# EAGLE board ComputeCalculator (EAGLE 7.2.0)
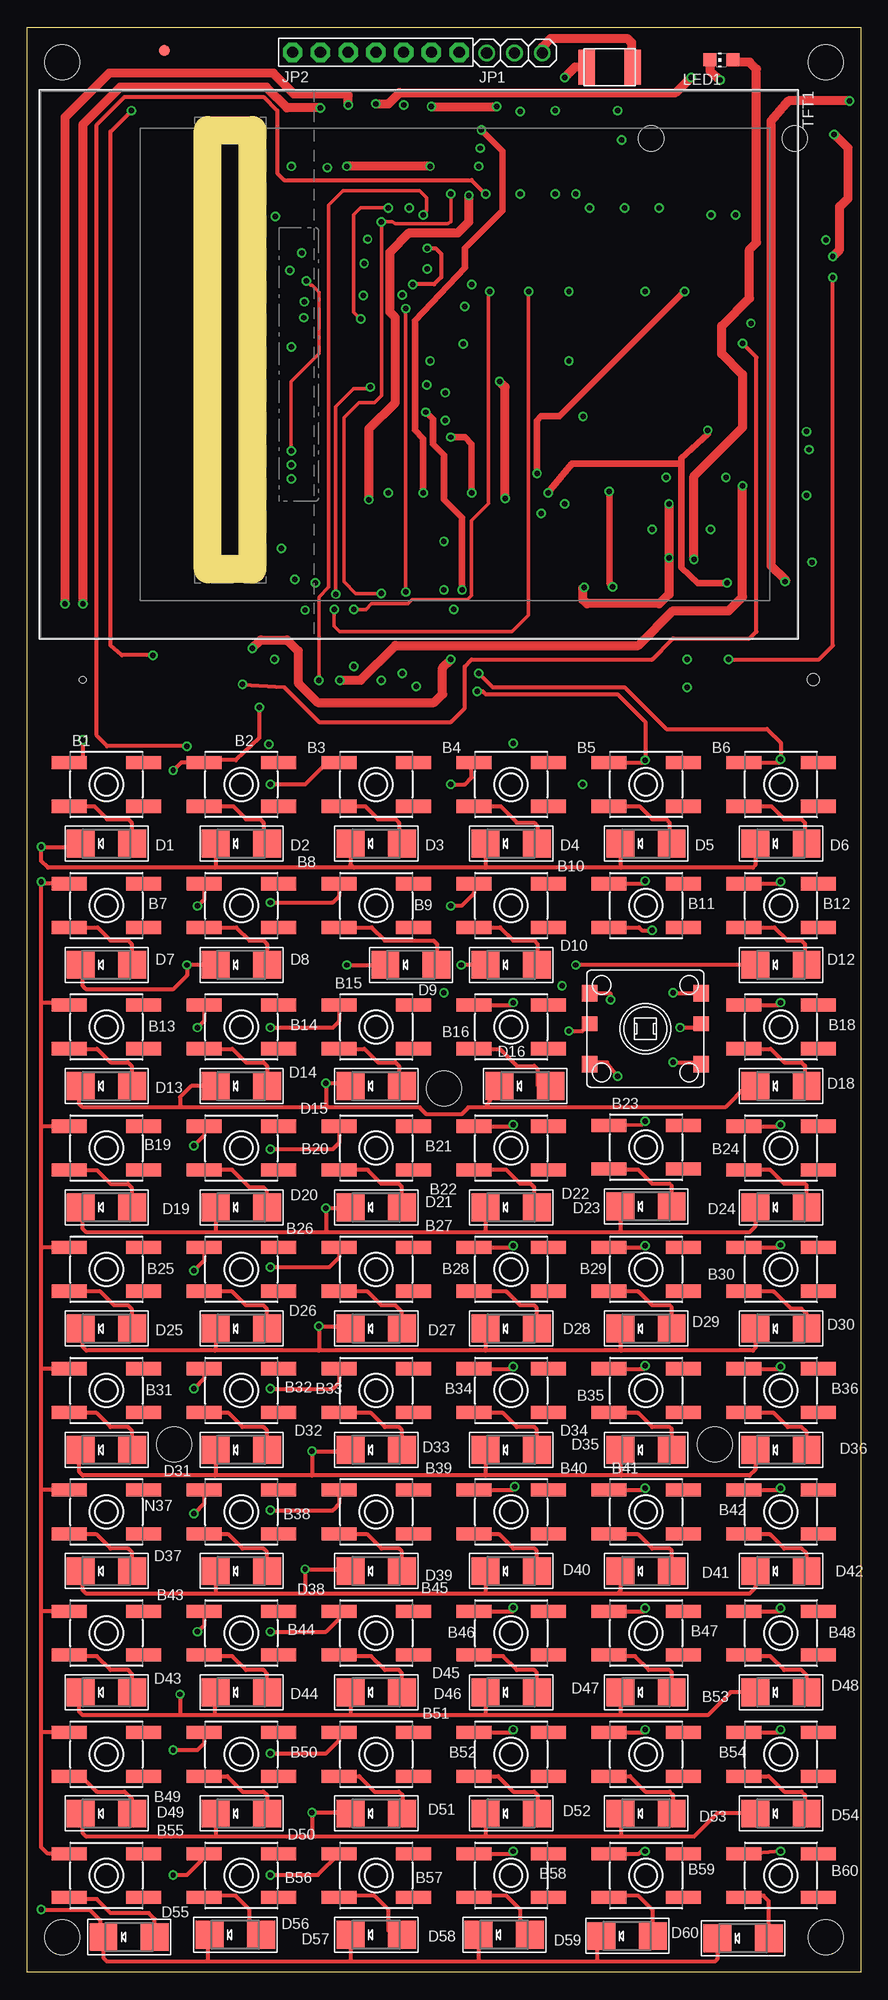
[diagram p5: board, top side]
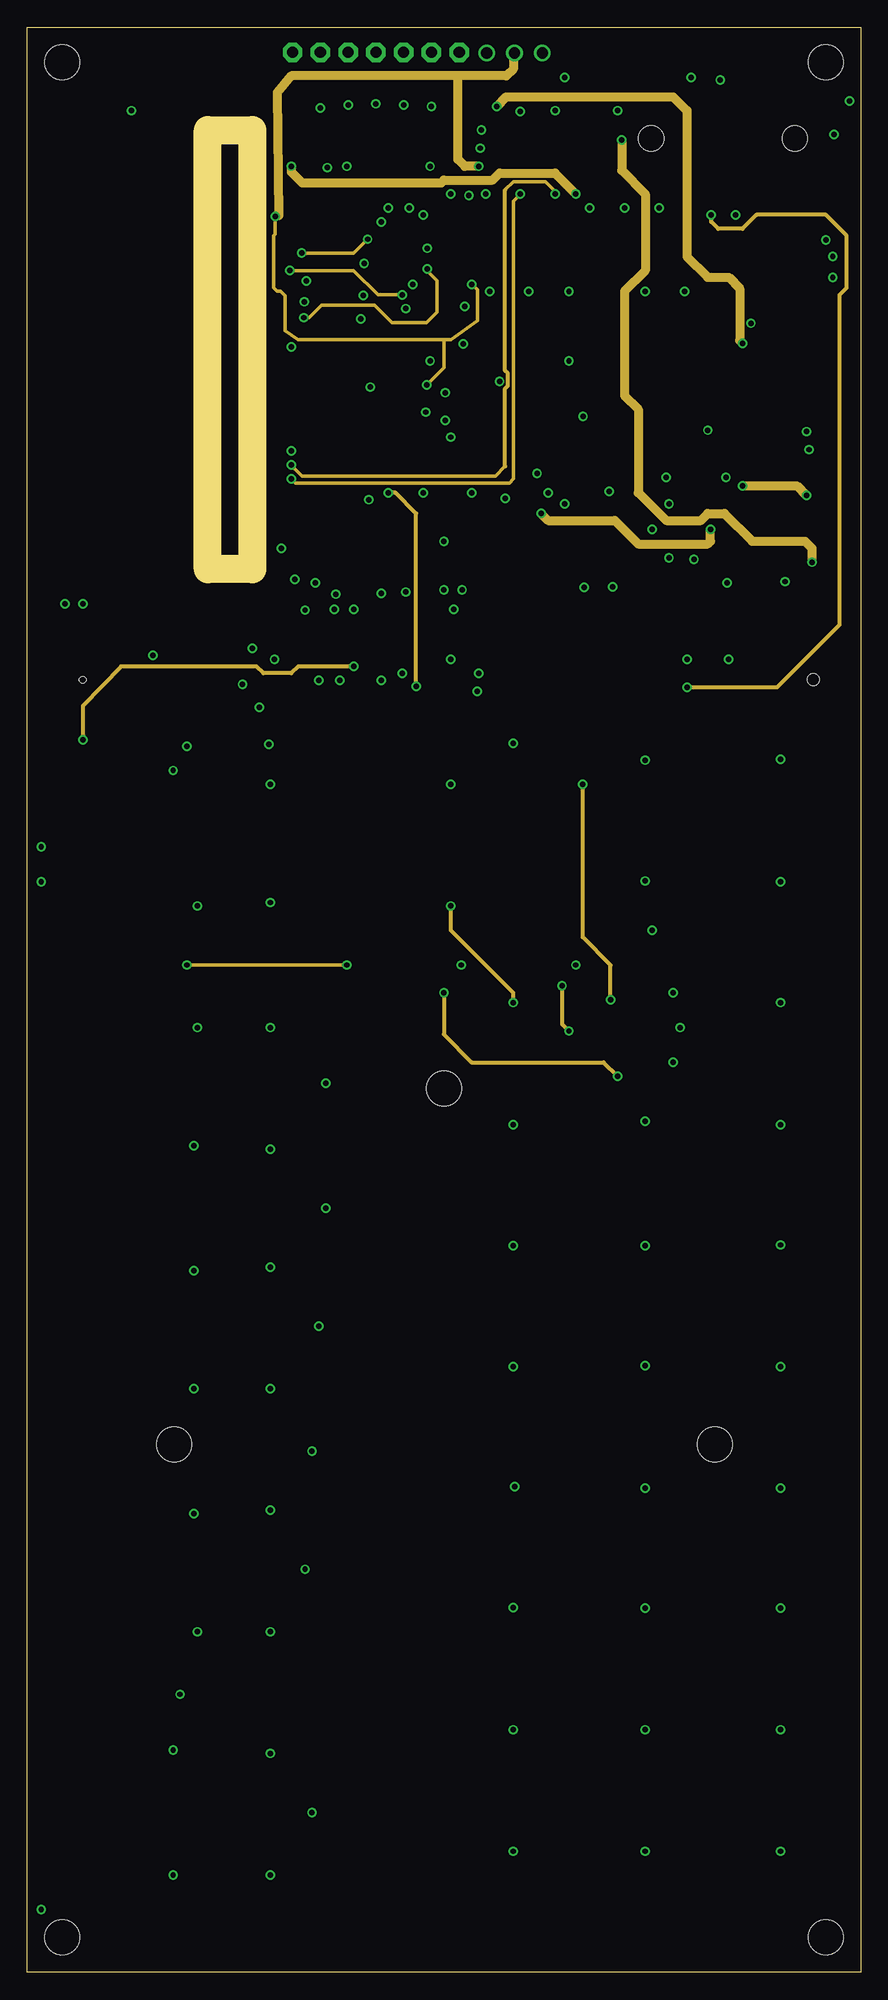
[diagram p6: board, inner layer Route2]
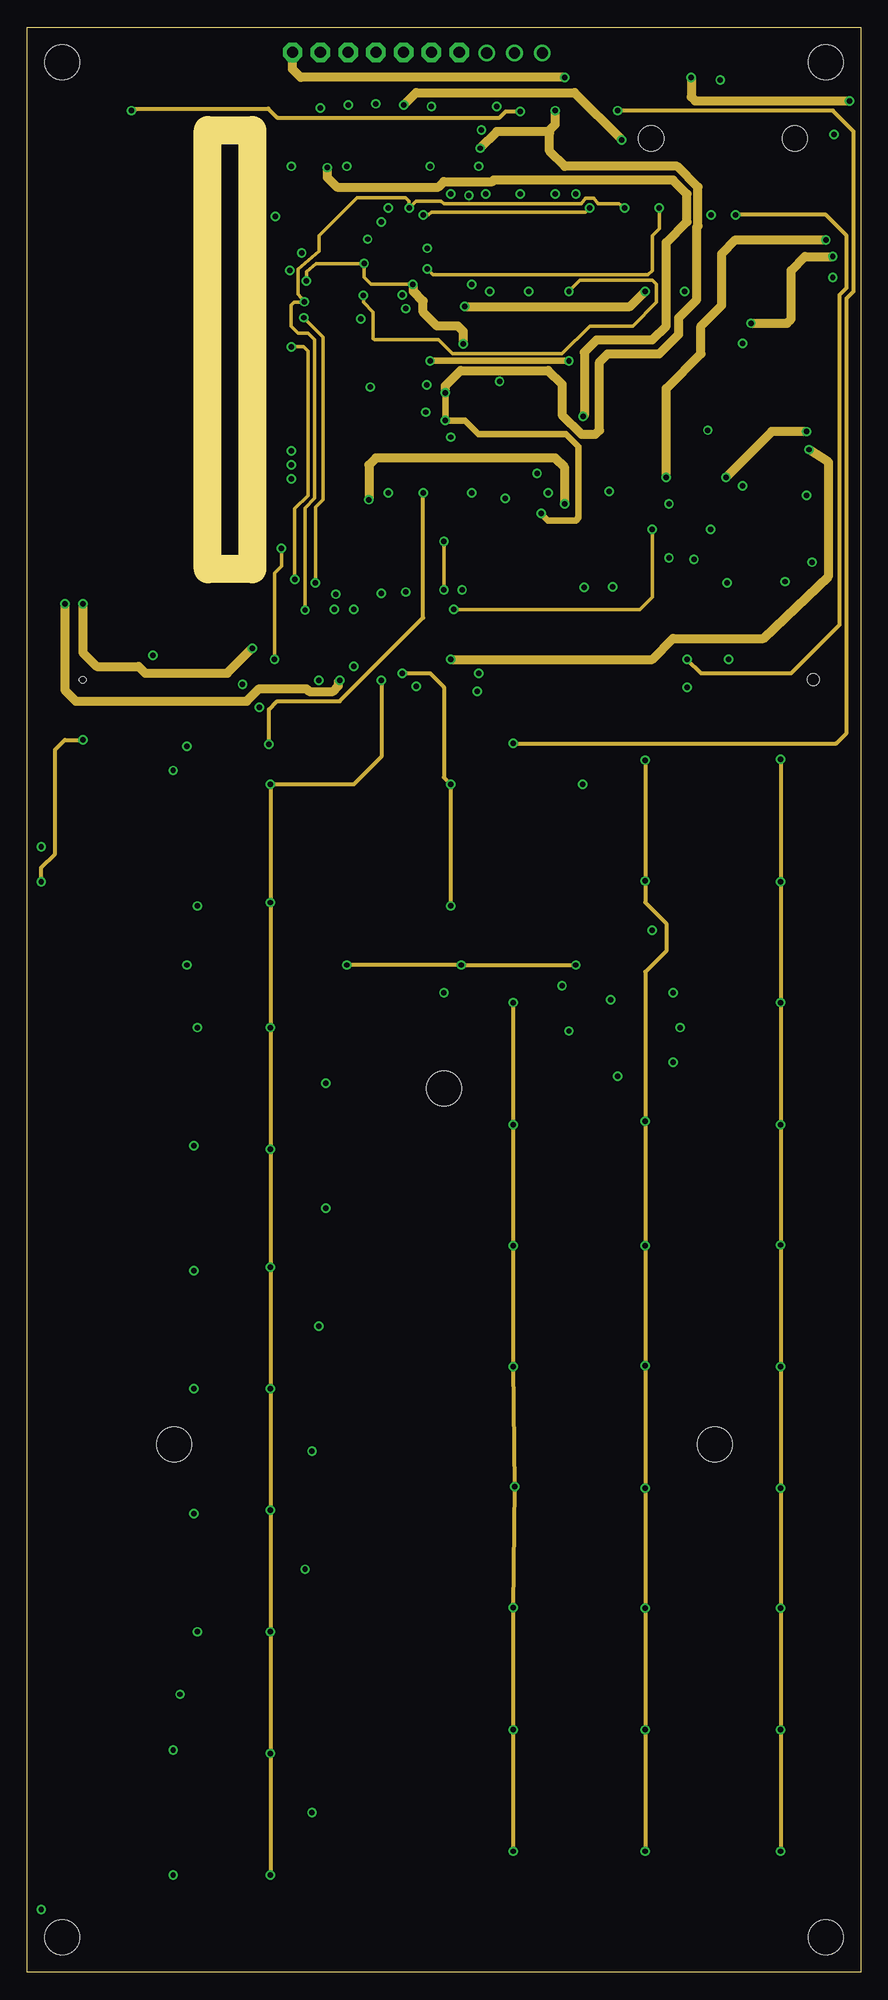
[diagram p7: board, inner layer Route15]
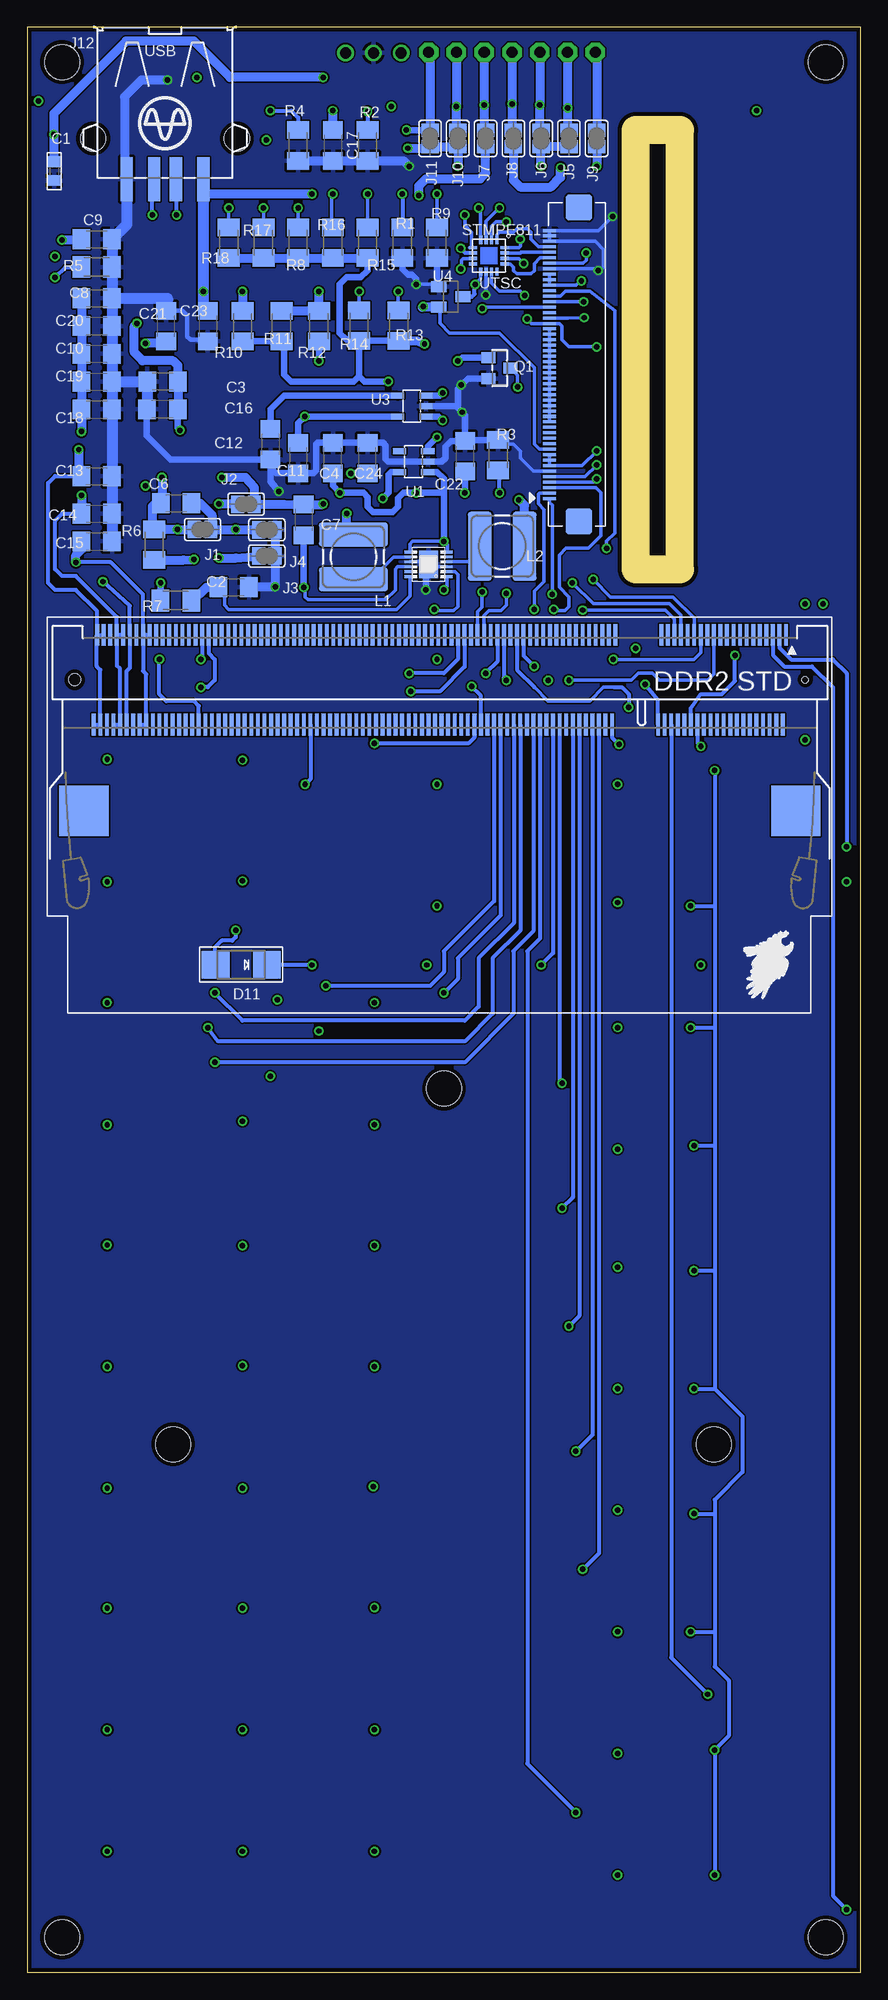
[diagram p8: board, bottom side, seen from below]

Size 76.2 x 177.8 mm. Coordinates in mm from the lower left corner, seen from the top.
Outline: 76.19,177.8 0,177.8 0,0 76.2,0 76.2,177.8
Outline: 16.51,168.4 20.57,168.4 20.57,128.27 16.51,128.27 16.51,168.4
Copper layers (1*2*15*16): Top 0.035559375mm / dielectric 0.17018125mm / Route2 0.01778125mm / dielectric 47mil / Route15 0.01778125mm / dielectric 0.17018125mm / Bottom 0.035559375mm
Design rules "OSHPARK_LaenPCBOrder_4Layer": minimum track width 6mil, minimum drill 13mil, track to track 6mil, track to pad 6mil, pad to pad 6mil, via to via 6mil, smd to smd 6mil, copper to edge 15mil, drill to drill 6mil, minimum pad ring 7mil, minimum via ring 7mil, stop-mask expansion 3mil, vias tented up to drill 0mil, thermal gap 10mil
Holes 3.2 mm at 3.18,174.62 73.03,174.62 3.18,3.18 73.03,3.18 13.42,48.26 62.87,48.26 38.1,80.77

## Footprints (pad centres in the part's own frame; a part is rotated, then mirrored left to right if it is on the bottom)
RPI_COMPUTE = smd 0.35 x 2: 1 -31.38,-4.1; 2 -31.08,4.1; 3 -30.78,-4.1; 4 -30.48,4.1; 5 -30.18,-4.1; 6 -29.88,4.1; 7 -29.58,-4.1; 8 -29.28,4.1; 9 -28.98,-4.1; 10 -28.68,4.1; 11 -28.38,-4.1; 12 -28.08,4.1; 13 -27.78,-4.1; 14 -27.48,4.1; 15 -27.18,-4.1; 16 -26.88,4.1; 17 -26.58,-4.1; 18 -26.28,4.1; 19 -25.98,-4.1; 20 -25.68,4.1; 21 -25.38,-4.1; 22 -25.08,4.1; 23 -24.78,-4.1; 24 -24.48,4.1; 25 -24.18,-4.1; 26 -23.88,4.1; 27 -23.58,-4.1; 28 -23.28,4.1; 29 -22.98,-4.1; 30 -22.68,4.1; 31 -22.38,-4.1; 32 -22.08,4.1; 33 -21.78,-4.1; 34 -21.48,4.1; 35 -21.18,-4.1; 36 -20.88,4.1; 37 -20.58,-4.1; 38 -20.28,4.1; 39 -19.98,-4.1; 40 -19.68,4.1; 41 -15.78,-4.1; 42 -15.48,4.1; 43 -15.18,-4.1; 44 -14.88,4.1; 45 -14.58,-4.1; 46 -14.28,4.1; 47 -13.98,-4.1; 48 -13.68,4.1; 49 -13.38,-4.1; 50 -13.08,4.1; 51 -12.78,-4.1; 52 -12.48,4.1; 53 -12.18,-4.1; 54 -11.88,4.1; 55 -11.58,-4.1; 56 -11.28,4.1; 57 -10.98,-4.1; 58 -10.68,4.1; 59 -10.38,-4.1; 60 -10.08,4.1; 61 -9.78,-4.1; 62 -9.48,4.1; 63 -9.18,-4.1; 64 -8.88,4.1; 65 -8.58,-4.1; 66 -8.28,4.1; 67 -7.98,-4.1; 68 -7.68,4.1; 69 -7.38,-4.1; 70 -7.08,4.1; 71 -6.78,-4.1; 72 -6.48,4.1; 73 -6.18,-4.1; 74 -5.88,4.1; 75 -5.58,-4.1; 76 -5.28,4.1; 77 -4.98,-4.1; 78 -4.68,4.1; 79 -4.38,-4.1; 80 -4.08,4.1; 81 -3.78,-4.1; 82 -3.48,4.1; 83 -3.18,-4.1; 84 -2.88,4.1; 85 -2.58,-4.1; 86 -2.28,4.1; 87 -1.98,-4.1; 88 -1.68,4.1; 89 -1.38,-4.1; 90 -1.08,4.1; 91 -0.78,-4.1; 92 -0.48,4.1; 93 -0.18,-4.1; 94 0.12,4.1; 95 0.42,-4.1; 96 0.72,4.1; 97 1.02,-4.1; 98 1.32,4.1; 99 1.62,-4.1; 100 1.92,4.1; 101 2.22,-4.1; 102 2.52,4.1; 103 2.82,-4.1; 104 3.12,4.1; 105 3.42,-4.1; 106 3.72,4.1; 107 4.02,-4.1; 108 4.32,4.1; 109 4.62,-4.1; 110 4.92,4.1; 111 5.22,-4.1; 112 5.52,4.1; 113 5.82,-4.1; 114 6.12,4.1; 115 6.42,-4.1; 116 6.72,4.1; 117 7.02,-4.1; 118 7.32,4.1; 119 7.62,-4.1; 120 7.92,4.1; 121 8.22,-4.1; 122 8.52,4.1; 123 8.82,-4.1; 124 9.12,4.1; 125 9.42,-4.1; 126 9.72,4.1; 127 10.02,-4.1; 128 10.32,4.1; 129 10.62,-4.1; 130 10.92,4.1; 131 11.22,-4.1; 132 11.52,4.1; 133 11.82,-4.1; 134 12.12,4.1; 135 12.42,-4.1; 136 12.72,4.1; 137 13.02,-4.1; 138 13.32,4.1; 139 13.62,-4.1; 140 13.92,4.1; 141 14.22,-4.1; 142 14.52,4.1; 143 14.82,-4.1; 144 15.12,4.1; 145 15.42,-4.1; 146 15.72,4.1; 147 16.02,-4.1; 148 16.32,4.1; 149 16.62,-4.1; 150 16.92,4.1; 151 17.22,-4.1; 152 17.52,4.1; 153 17.82,-4.1; 154 18.12,4.1; 155 18.42,-4.1; 156 18.72,4.1; 157 19.02,-4.1; 158 19.32,4.1; 159 19.62,-4.1; 160 19.92,4.1; 161 20.22,-4.1; 162 20.52,4.1; 163 20.82,-4.1; 164 21.12,4.1; 165 21.42,-4.1; 166 21.72,4.1; 167 22.02,-4.1; 168 22.32,4.1; 169 22.62,-4.1; 170 22.92,4.1; 171 23.22,-4.1; 172 23.52,4.1; 173 23.82,-4.1; 174 24.12,4.1; 175 24.42,-4.1; 176 24.72,4.1; 177 25.02,-4.1; 178 25.32,4.1; 179 25.62,-4.1; 180 25.92,4.1; 181 26.22,-4.1; 182 26.52,4.1; 183 26.82,-4.1; 184 27.12,4.1; 185 27.42,-4.1; 186 27.72,4.1; 187 28.02,-4.1; 188 28.32,4.1; 189 28.62,-4.1; 190 28.92,4.1; 191 29.22,-4.1; 192 29.52,4.1; 193 29.82,-4.1; 194 30.12,4.1; 195 30.42,-4.1; 196 30.72,4.1; 197 31.02,-4.1; 198 31.32,4.1; 199 31.62,-4.1; 200 31.92,4.1 | smd 4.5 x 4.6: M1 -32.28,12; M2 32.82,12 | hole 0.6: -33.13,0 | hole 1.1: 33.67,0
FIDUCIAL_1MM = smd 1 x 1: 1 0,0
EVQ-Q2 = smd 3.2 x 1.2: A -3.4,-2; A' 3.4,-2; B -3.4,2; B' 3.4,2
SKQU = smd 1.4 x 1.5: 1 -5.1,3.25; 3 -5.1,-3.25; 4 5.1,-3.25; 6 5.1,3.25 | smd 1.4 x 1.3: 2 -5.1,-0.45; 5 5.1,-0.45
C0603 = smd 1 x 1.1: 1 -0.85,0; 2 0.85,0
C1206 = smd 1.6 x 1.8: 1 -1.4,0; 2 1.4,0
SMADIODE = smd 2.54 x 2.54: A 2.349,0; C -2.349,0
MF-MSMF200 = smd 1.5 x 3.2: P$1 -2.1,0; P$2 2.1,0
SJW = smd 1.168 x 1.6: 1 -0.762,0; 2 0.762,0
USB-A003 = smd 1.12 x 4: 1 -3.5,14; 2 -1,14; 3 1,14; 4 3.5,14 | hole 2.3: -6.57,10.28; 6.57,10.28
1X03 = drill 1.016: 1 -2.54,0; 2 0,0; 3 2.54,0
1X7-BIG = drill 1.016 pad 1.778 octagon: 1 -7.62,0; 2 -5.08,0; 3 -2.54,0; 4 0,0; 5 2.54,0; 6 5.08,0; 7 7.62,0
POWER-CHOKE_WE-TPC = smd 6.3 x 2.2: 1 0,2.05; 2 0,-2.05
CHIP-LED0805 = smd 1.2 x 1.2: A 0,-1.05; C 0,1.05
SOT23-WIDE = smd 1 x 1.27: 1 -0.95,-1; 2 0.95,-1; 3 0,1
M1206 = smd 1.6 x 2: 1 -1.4,0; 2 1.4,0
TFT_CTP28 = smd 0.275 x 1.2 bottom: 1 12.25,-7.36; 2 11.75,-7.36; 3 11.25,-7.36; 4 10.75,-7.36; 5 10.25,-7.36; 6 9.75,-7.36; 7 9.25,-7.36; 8 8.75,-7.36; 9 8.25,-7.36; 10 7.75,-7.36; 11 7.25,-7.36; 12 6.75,-7.36; 13 6.25,-7.36; 14 5.75,-7.36; 15 5.25,-7.36; 16 4.75,-7.36; 17 4.25,-7.36; 18 3.75,-7.36; 19 3.25,-7.36; 20 2.75,-7.36; 21 2.25,-7.36; 22 1.75,-7.36; 23 1.25,-7.36; 24 0.75,-7.36; 25 0.25,-7.36; 26 -0.25,-7.36; 27 -0.75,-7.36; 28 -1.25,-7.36; 29 -1.75,-7.36; 30 -2.25,-7.36; 31 -2.75,-7.36; 32 -3.25,-7.36; 33 -3.75,-7.36; 34 -4.25,-7.36; 35 -4.75,-7.36; 36 -5.25,-7.36; 37 -5.75,-7.36; 38 -6.25,-7.36; 39 -6.75,-7.36; 40 -7.25,-7.36; 41 -7.75,-7.36; 42 -8.25,-7.36; 43 -8.75,-7.36; 44 -9.25,-7.36; 45 -9.75,-7.36; 46 -10.25,-7.36; 47 -10.75,-7.36; 48 -11.25,-7.36; 49 -11.75,-7.36; 50 -12.25,-7.36 | smd 2.4 x 2.4 bottom: PAD1 14.35,-10.06; PAD2 -14.35,-10.06
SOT-25 = smd 0.55 x 1.2: 1 -0.95,-1.3; 2 0,-1.3; 3 0.95,-1.3; 4 0.95,1.3; 5 -0.95,1.3
WDFN_12L = smd 1 x 0.25: 1 -1.7,1.125; 2 -1.7,0.675; 3 -1.7,0.225; 4 -1.7,-0.225; 5 -1.7,-0.675; 6 -1.7,-1.125; 7 1.7,-1.125; 8 1.7,-0.675; 9 1.7,-0.225; 10 1.7,0.225; 11 1.7,0.675; 12 1.7,1.125 | smd 1.7 x 2.5: 13 0,0
SOT23 = smd 1 x 1.4: 1 -0.95,-1.1; 2 0.95,-1.1; 3 0,1.1
QFN16L = smd 0.75 x 0.3: 1 -1.45,0.75; 2 -1.45,0.25; 3 -1.45,-0.25; 4 -1.45,-0.75; 9 1.45,-0.75; 10 1.45,-0.25; 11 1.45,0.25; 12 1.45,0.75 | smd 0.3 x 0.75: 5 -0.75,-1.45; 6 -0.25,-1.45; 7 0.25,-1.45; 8 0.75,-1.45; 13 0.75,1.45; 14 0.25,1.45; 15 -0.25,1.45; 16 -0.75,1.45

## Placement (x,y rotation side)
$$PCB100  RPI_COMPUTE  [RPI_COMPUTE]  38.2,118.16 180 bottom
$$U$1  FIDUCIAL  [FIDUCIAL_1MM]  12.54,175.69 0 top
B1  A0  [EVQ-Q2]  7.23,108.59 0 top
B2  B0  [EVQ-Q2]  19.57,108.59 0 top
B3  C0  [EVQ-Q2]  31.91,108.59 0 top
B4  D0  [EVQ-Q2]  44.24,108.59 0 top
B5  E0  [EVQ-Q2]  56.58,108.59 0 top
B6  F0  [EVQ-Q2]  68.92,108.59 0 top
B7  A1  [EVQ-Q2]  7.23,97.5 0 top
B8  B1  [EVQ-Q2]  19.57,97.5 0 top
B9  C1  [EVQ-Q2]  31.91,97.5 0 top
B10  D1  [EVQ-Q2]  44.24,97.5 0 top
B11  E1  [EVQ-Q2]  56.58,97.5 0 top
B12  F1  [EVQ-Q2]  68.92,97.5 0 top
B13  A2  [EVQ-Q2]  7.23,86.42 0 top
B14  B2  [EVQ-Q2]  19.57,86.42 0 top
B15  C2  [EVQ-Q2]  31.91,86.42 0 top
B16  D2  [EVQ-Q2]  44.24,86.42 0 top
B17  SKQU  [SKQU]  56.51,86.25 180 top
B18  F2  [EVQ-Q2]  68.92,86.42 0 top
B19  A3  [EVQ-Q2]  7.23,75.34 0 top
B20  B3  [EVQ-Q2]  19.57,75.34 0 top
B21  C3  [EVQ-Q2]  31.91,75.34 0 top
B22  D3  [EVQ-Q2]  44.24,75.34 0 top
B23  E3  [EVQ-Q2]  56.58,75.42 0 top
B24  F3  [EVQ-Q2]  68.92,75.34 0 top
B25  A4  [EVQ-Q2]  7.23,64.25 0 top
B26  B4  [EVQ-Q2]  19.57,64.25 0 top
B27  C4  [EVQ-Q2]  31.91,64.25 0 top
B28  D4  [EVQ-Q2]  44.24,64.25 0 top
B29  E4  [EVQ-Q2]  56.58,64.25 0 top
B30  F4  [EVQ-Q2]  68.92,64.25 0 top
B31  A5  [EVQ-Q2]  7.23,53.17 0 top
B32  B5  [EVQ-Q2]  19.57,53.17 0 top
B33  C5  [EVQ-Q2]  31.91,53.17 0 top
B34  D5  [EVQ-Q2]  44.24,53.17 0 top
B35  E5  [EVQ-Q2]  56.58,53.17 0 top
B36  F5\  [EVQ-Q2]  68.92,53.17 0 top
B38  B6  [EVQ-Q2]  19.57,42.09 0 top
B39  C6  [EVQ-Q2]  31.91,42.09 0 top
B40  D6  [EVQ-Q2]  44.24,42.09 0 top
B41  E6  [EVQ-Q2]  56.58,42.09 0 top
B42  F6  [EVQ-Q2]  68.92,42.09 0 top
B43  A7  [EVQ-Q2]  7.23,31 0 top
B44  B7  [EVQ-Q2]  19.57,31 0 top
B45  C7  [EVQ-Q2]  31.91,31 0 top
B46  D7  [EVQ-Q2]  44.24,31 0 top
B47  E7  [EVQ-Q2]  56.58,31 0 top
B48  F7  [EVQ-Q2]  68.92,31 0 top
B49  A8  [EVQ-Q2]  7.23,19.92 0 top
B50  B8  [EVQ-Q2]  19.57,19.92 0 top
B51  C8  [EVQ-Q2]  31.91,19.92 0 top
B52  D8  [EVQ-Q2]  44.24,19.92 0 top
B53  E8  [EVQ-Q2]  56.58,19.92 0 top
B54  F8  [EVQ-Q2]  68.92,19.92 0 top
B55  A9  [EVQ-Q2]  7.23,8.83 0 top
B56  B9  [EVQ-Q2]  19.57,8.83 0 top
B57  C9  [EVQ-Q2]  31.91,8.83 0 top
B58  D9  [EVQ-Q2]  44.24,8.83 0 top
B59  E9  [EVQ-Q2]  56.58,8.83 0 top
B60  F9  [EVQ-Q2]  68.92,8.83 0 top
C1  47uF  [C0603]  73.74,164.65 270 bottom
C2  100nF  [C1206]  57.33,126.62 0 bottom
C3  10uF  [C1206]  63.83,145.42 180 bottom
C4  10uF  [C1206]  48.26,138.43 90 bottom
C6  NF  [C1206]  62.58,134.3 0 bottom
C7  NF  [C1206]  50.94,132.77 270 bottom
C8  10uF  [C1206]  69.85,153.04 0 bottom
C9  10uF  [C1206]  69.85,158.43 0 bottom
C10  1uF  [C1206]  69.85,147.96 0 bottom
C11  4.7uF  [C1206]  51.44,138.43 270 bottom
C12  100nF  [C1206]  53.98,139.7 270 bottom
C13  47uF  [C1206]  69.85,136.78 0 bottom
C14  47uF  [C1206]  69.85,133.35 0 bottom
C15  47uF  [C1206]  69.85,130.81 0 bottom
C16  10uF  [C1206]  63.85,142.88 180 bottom
C17  10uF  [C1206]  48.26,167 270 bottom
C18  0.1uF  [C1206]  69.85,142.88 0 bottom
C19  0.1uF  [C1206]  69.85,145.42 0 bottom
C20  0.1uF  [C1206]  69.85,150.5 0 bottom
C21  1uF  [C1206]  63.5,150.5 90 bottom
C22  1uF  [C1206]  36.16,138.6 90 bottom
C23  47uF  [C1206]  59.69,150.5 270 bottom
C24  47uF  [C1206]  45.09,138.43 90 bottom
D1  [SMADIODE]  7.23,103.18 0 top
D2  [SMADIODE]  19.57,103.18 0 top
D3  [SMADIODE]  31.91,103.18 0 top
D4  [SMADIODE]  44.24,103.18 0 top
D5  [SMADIODE]  56.58,103.18 0 top
D6  [SMADIODE]  68.92,103.18 0 top
D7  [SMADIODE]  7.23,92.09 0 top
D8  [SMADIODE]  19.57,92.09 0 top
D9  [SMADIODE]  35.08,92.09 0 top
D10  [SMADIODE]  44.24,92.09 0 top
D11  [SMADIODE]  56.64,92.1 180 bottom
D12  [SMADIODE]  68.92,92.09 0 top
D13  [SMADIODE]  7.23,81.01 0 top
D14  [SMADIODE]  19.57,81.01 0 top
D15  [SMADIODE]  31.91,81.01 0 top
D16  [SMADIODE]  45.51,81.01 0 top
D18  [SMADIODE]  68.92,81.01 0 top
D19  [SMADIODE]  7.23,69.92 0 top
D20  [SMADIODE]  19.57,69.92 0 top
D21  [SMADIODE]  31.91,69.92 0 top
D22  [SMADIODE]  44.24,69.92 0 top
D23  [SMADIODE]  56.58,70.01 0 top
D24  [SMADIODE]  68.92,69.92 0 top
D25  [SMADIODE]  7.23,58.84 0 top
D26  [SMADIODE]  19.57,58.84 0 top
D27  [SMADIODE]  31.91,58.84 0 top
D28  [SMADIODE]  44.24,58.84 0 top
D29  [SMADIODE]  56.58,58.84 0 top
D30  [SMADIODE]  68.92,58.84 0 top
D31  [SMADIODE]  7.23,47.76 0 top
D32  [SMADIODE]  19.57,47.76 0 top
D33  [SMADIODE]  31.91,47.76 0 top
D34  [SMADIODE]  44.24,47.76 0 top
D35  [SMADIODE]  56.58,47.76 0 top
D36  [SMADIODE]  68.92,47.76 0 top
D37  [SMADIODE]  7.23,36.67 0 top
D38  [SMADIODE]  19.57,36.67 0 top
D39  [SMADIODE]  31.91,36.67 0 top
D40  [SMADIODE]  44.24,36.67 0 top
D41  [SMADIODE]  56.58,36.67 0 top
D42  [SMADIODE]  68.92,36.67 0 top
D43  [SMADIODE]  7.23,25.59 0 top
D44  [SMADIODE]  19.57,25.59 0 top
D45  [SMADIODE]  31.91,25.59 0 top
D46  [SMADIODE]  44.24,25.59 0 top
D47  [SMADIODE]  56.58,25.59 0 top
D48  [SMADIODE]  68.92,25.59 0 top
D49  [SMADIODE]  7.23,14.51 0 top
D50  [SMADIODE]  19.57,14.51 0 top
D51  [SMADIODE]  31.91,14.51 0 top
D52  [SMADIODE]  44.24,14.51 0 top
D53  [SMADIODE]  56.58,14.51 0 top
D54  [SMADIODE]  68.92,14.51 0 top
D55  [SMADIODE]  9.31,3.21 0 top
D56  [SMADIODE]  19.02,3.42 0 top
D57  [SMADIODE]  31.91,3.42 0 top
D58  [SMADIODE]  43.61,3.42 0 top
D59  [SMADIODE]  54.85,3.31 0 top
D60  [SMADIODE]  65.45,3.1 0 top
F1  MF-MSMF200  [MF-MSMF200]  53.25,174.16 180 top
J1  [SJW]  60.17,131.89 180 bottom
J2  [SJW]  56.2,134.21 0 bottom
J3  [SJW]  54.3,129.47 180 bottom
J4  [SJW]  54.3,131.87 180 bottom
J5  [SJW]  26.67,167.64 270 bottom
J6  [SJW]  29.21,167.64 270 bottom
J7  [SJW]  34.29,167.64 270 bottom
J8  [SJW]  31.75,167.64 270 bottom
J9  [SJW]  24.13,167.64 90 bottom
J10  [SJW]  36.83,167.64 270 bottom
J11  [SJW]  39.37,167.64 90 bottom
J12  61400416021  [USB-A003]  63.61,177.93 180 bottom
JP1  [1X03]  44.55,175.46 180 top
JP2  1X7-BIG  [1X7-BIG]  31.88,175.51 0 top
L1  SRN4018-4R7M  [POWER-CHOKE_WE-TPC]  46.38,129.39 180 bottom
L2  SRN4018-4R7M  [POWER-CHOKE_WE-TPC]  32.77,130.37 90 bottom
LED1  RED  [CHIP-LED0805]  63.48,174.82 90 top
N37  A6  [EVQ-Q2]  7.23,42.09 0 top
Q1  MMBT2222  [SOT23-WIDE]  33.02,146.65 270 bottom
R1  100KΩ  [M1206]  41.91,158.12 90 bottom
R2  100KΩ  [M1206]  45.09,167 90 bottom
R3  100KΩ  [M1206]  33.15,138.68 270 bottom
R4  100KΩ  [M1206]  51.44,167 90 bottom
R5  100KΩ  [M1206]  69.85,155.89 180 bottom
R6  470Ω  [M1206]  64.6,130.5 90 bottom
R7  100KΩ  [M1206]  62.62,125.41 180 bottom
R8  10K  [M1206]  51.44,158.12 90 bottom
R9  10K  [M1206]  38.73,158.12 270 bottom
R10  100  [M1206]  56.52,150.5 270 bottom
R11  1K  [M1206]  52.96,150.5 90 bottom
R12  1K  [M1206]  49.53,150.5 270 bottom
R13  100  [M1206]  42.25,150.54 270 bottom
R14  100  [M1206]  45.87,150.53 270 bottom
R15  100  [M1206]  45.09,158.12 270 bottom
R16  100  [M1206]  48.26,158.12 270 bottom
R17  22  [M1206]  54.61,158.12 90 bottom
R18  22  [M1206]  57.78,158.12 90 bottom
TFT1  [TFT_CTP28]  35.81,146.98 270 top
U1  MIC5225  [SOT-25]  40.88,138.09 90 bottom
U2  PAM2306AYPKE  [WDFN_12L]  39.51,128.71 180 bottom
U3  AP7115-25SEG  [SOT-25]  41.05,143.18 90 bottom
U4  MAXP803  [SOT23]  37.47,153.16 270 bottom
UTSC  STMPE811  [QFN16L]  34,156.92 270 bottom

## Tracks (layer width: path | path; a pad name or v marks a point on that pad's centre or on a via)
1V8  (via drill 0.5)
  Top 0.813: v31.24,134.62 31.24,141.1 33.66,143.51 33.66,151.26 33.15,151.77 33.15,157.23 34.93,159 39.37,159 40.39,160.02 v40.39,162.43
  Route15 0.813: v49.15,134.24 49.15,137.54 48.26,138.43 31.88,138.43 31.24,137.8 v31.24,134.62 | v58.42,136.65 58.42,144.78 61.59,147.96 61.59,150.5 63.5,152.4 63.5,157.1 64.77,158.37 v73.03,158.37
  Bottom 0.813: L2.2 30.72,134.1 v31.24,134.62 | v40.39,162.43 40.39,163.32 39.75,163.96 34.8,163.96 34.29,164.47 J7.2 | v49.15,134.24 49.22,134.17 C7.1 52.76,134.21 J2.2 55.43,135.7 56.26,136.65 v58.42,136.65 | v73.03,158.37 71.31,158.37 C9.1
3V3  (via drill 0.5)
  Top 0.813: v36.83,165.1 v29.21,165.1
  Route2 0.813: v46.99,133.35 47.62,132.72 53.72,132.72 55.88,130.56 62.23,130.56 62.48,130.81 v62.48,131.89
  Route15 0.61: v46.99,133.35 47.62,132.72 50.16,132.72 50.42,132.97 50.42,139.45 49.28,140.59 41.27,140.59 40.01,141.86 v38.23,141.86 v38.23,144.4
  Route15 0.813: v71.25,140.84 68.07,140.84 v63.88,136.65 | v48.26,170.18 48.26,168.91 47.62,168.28 | 47.62,168.28 42.93,168.28 v41.4,166.75 | v38.23,144.4 38.23,145.03 39.62,146.43 47.62,146.43 48.9,145.16 48.9,142.37 50.67,140.59 51.94,140.59 52.32,140.97 52.32,147.19 53.09,147.96 57.78,147.96 59.56,149.73 59.56,151.26 61.21,152.91 61.21,159.51 61.34,159.64 61.34,163.19 59.44,165.1 49.15,165.1 47.75,166.5 47.75,168.15 47.62,168.28
  Bottom 0.61: U3.1 38.59,142.23 v38.23,141.86 | U3.3 38.5,144.12 v38.23,144.4
  Bottom 0.813: J5.2 J6.2 v29.21,165.1 | v36.83,165.1 J10.2 J11.1 39.5,166.75 v41.4,166.75 | C8.1 C20.1 C10.1 C19.1 C18.1 v71.25,140.85 v71.25,140.84 | v63.88,136.65 63.88,134.39 C6.1 64.45,134.3 64.77,133.99 64.77,132.07 R6.2 63.95,131.89 v62.48,131.89 J1.2 | L1.2 47.01,132.1 v46.99,133.35 | C17.1 v48.26,170.18
5V  (via drill 0.5)
  Top 0.61: v62.23,140.97 62.23,140.59 59.82,138.43 59.82,137.92 | 59.82,137.92 49.78,137.92 v47.62,135.25 | v38.73,140.34 40.01,140.34 40.64,139.7 v40.64,135.25 | v64.01,127 61.34,127 59.82,128.4 59.82,137.92
  Top 0.813: v73.66,156.84 74.3,157.48 74.3,161.42 75.06,162.18 75.06,166.75 v73.79,168.02 | F1.P$2 50.08,174.16 v49.15,173.23
  Route15 0.305: v38.1,126.37 v38.1,130.81
  Route15 0.813: v66.17,150.75 69.47,150.75 69.85,151.13 69.85,155.57 71.12,156.84 v73.66,156.84 | v49.15,173.23 25,173.23 24.23,173.99 24.26,173.99 JP2.1
  Bottom 0.305: U2.6 37.78,129.86 37.78,130.49 v38.1,130.81 40.96,130.81 41.21,130.56 U2.7 | U2.1 37.81,126.66 v38.1,126.37
  Bottom 0.61: U1.1 38.72,137.15 38.1,136.53 38.1,135.25 | v38.1,130.81 38.1,135.25 | 38.1,135.25 v40.64,135.25 41.78,135.25 42.29,134.75 42.29,133.99 42.8,133.48 44.58,133.48 45.09,133.99 45.09,134.87 45.47,135.25 v47.62,135.25 48.26,135.89 C4.1 | C16.1 62.45,141.19 v62.23,140.97 | U1.3 39.58,139.5 v38.73,140.34 | R7.2 v64.02,126.99 v64.01,127
  Bottom 0.813: 24.23,168.51 J9.2 24.13,175.51 JP2.1 | C16.1 62.43,142.9 C3.1 62.43,146.88 62.87,147.32 65.66,147.32 66.42,148.08 66.42,150.5 v66.17,150.75 | C1.1 73.79,165.55 v73.79,168.02 73.79,169.93 67.18,176.53 60.96,176.53 57.66,173.23 v49.15,173.23
A  (via drill 0.5)
  Top 0.356: v59.05,83.19 61.43,83.19 B17.1
  Bottom 0.356: $$PCB100.66 29.92,95.18 31.75,93.34 31.75,87.63 36.2,83.19 v59.05,83.19
B  (via drill 0.5)
  Top 0.356: v59.69,86.36 61.27,86.36 B17.2
  Bottom 0.356: $$PCB100.70 31.12,95.25 33.66,92.71 33.66,87.63 36.2,85.09 58.74,85.09 v59.69,86.36
C  (via drill 0.5)
  Top 0.356: v59.05,89.54 61.58,89.54 B17.3
  Bottom 0.356: $$PCB100.72 31.72,95.92 34.93,92.71 34.93,88.27 36.2,87 56.52,87 v59.05,89.54
CENTER  (via drill 0.5)
  Top 0.356: v53.98,81.92 53.02,83.19 51.6,83.19 B17.6
  Route2 0.356: v38.1,89.54 38.1,85.73 40.64,83.19 52.7,83.19 v53.98,81.92
  Bottom 0.356: $$PCB100.76 32.92,96.62 36.83,92.71 36.83,90.81 v38.1,89.54
CM_1V8  (via drill 0.5)
  Route2 0.813: v54.36,167.51 54.36,164.72 56.52,162.56 56.52,155.57 54.61,153.67 54.61,144.15 55.88,142.88 55.88,135.25 58.42,132.72 61.59,132.72 62.23,133.35 63.75,133.35 66.29,130.81 71.12,130.81 71.75,130.18 v71.75,128.91
  Route15 0.813: v34.42,170.69 35.56,171.83 50.04,171.83 v54.36,167.51
  Bottom 0.356: $$PCB100.186 $$PCB100.184 65.32,118.66 65.62,118.96 $$PCB100.185 | $$PCB100.183 $$PCB100.185 | $$PCB100.185 65.62,125.95 68.58,128.91 v71.75,128.91 | 71.12,130.18 71.12,130.68 C15.1
  Bottom 0.813: J7.1 34.4,168.51 34.4,170.67 v34.42,170.69 JP2.5 | v71.75,128.91 71.75,129.54 71.12,130.18
CM_3V3  (via drill 0.5)
  Top 0.813: v29.34,170.69 29.34,171.58 29.21,171.7 24.38,171.7 22.48,173.61 7.49,173.61 3.43,169.55 v3.43,125.09 | v28.58,118.11 30.48,118.11 33.66,121.28 55.88,121.28 59.05,124.46 64.14,124.46 65.41,125.73 v65.41,135.89
  Route2 0.813: v65.41,135.89 70.36,135.89 v71.25,135
  Route15 0.813: v3.43,125.09 3.43,117.22 4.45,116.21 20.07,116.21 21.21,117.35 25.53,117.35 25.78,117.09 27.94,117.09 28.45,117.6 28.45,117.98 v28.58,118.11
  Bottom 0.356: $$PCB100.194 $$PCB100.192 67.72,119.16 68.02,119.46 $$PCB100.193 | $$PCB100.191 $$PCB100.193 | $$PCB100.193 68.02,123.9 71.75,127.64 73.03,127.64 73.66,128.27 73.66,132.72 73.03,133.35 C14.1
  Bottom 0.813: J6.1 29.32,168.51 29.32,170.67 v29.34,170.69 JP2.3 | v71.25,135 C14.1
CM_VBAT  (via drill 0.5)
  Top 0.813: v26.8,170.43 23.75,170.43 21.84,172.34 8.51,172.34 5.08,168.91 v5.08,125.09 | v20.57,121.03 21.34,121.79 23.75,121.79 24.77,120.78 24.77,117.86 26.54,116.08 37.21,116.08 37.97,116.84 37.97,119.25 v38.73,120.02
  Route15 0.813: v5.08,125.09 5.08,120.65 6.35,119.38 10.16,119.38 10.8,118.75 18.29,118.75 v20.57,121.03 | v38.73,120.02 57.15,120.02 59.05,121.92 67.31,121.92 73.28,127.64 73.28,138.05 v71.5,139.19
  Bottom 0.356: $$PCB100.200 $$PCB100.198 69.52,119.05 69.85,119.38 69.85,122.23 $$PCB100.199 | $$PCB100.199 $$PCB100.197 | $$PCB100.199 69.82,124.43 71.75,126.37 73.66,126.37 74.3,127 74.3,136.14 73.66,136.78 C13.1
  Bottom 0.813: J5.1 26.78,168.51 26.78,170.41 v26.8,170.43 JP2.2 | v71.5,139.19 71.5,136.78 C13.1
CM_VDAC  (via drill 0.5)
  Top 0.813: v31.88,170.81 33.02,170.81 34.04,171.83 59.31,171.83 v60.71,173.23 | v75.18,171.07 69.6,171.07 68.01,169.23 68.01,128.59 69.34,127.25 69.34,127.19 v69.28,127.13
  Route15 0.813: v60.71,173.23 60.71,171.45 61.09,171.07 v75.18,171.07
  Bottom 0.356: $$PCB100.190 67.12,118.94 66.82,119.24 $$PCB100.189 66.82,124.92 v69.28,127.13
  Bottom 0.813: J8.1 31.86,168.51 31.86,170.71 v31.88,170.81 JP2.4
COL_0  (via drill 0.5)
  Top 0.356: B7.B 1.46,99.5 v1.27,99.7 1.27,88.58 | v5.08,112.65 5.08,111 4.7,110.62 3.81,110.61 B1.B | B55.B 1.87,10.84 1.27,11.43 1.27,21.91 | 1.27,21.91 1.27,33.02 | 1.27,33.02 1.27,44.13 | 1.27,44.13 1.27,55.25 | 1.27,55.25 1.27,66.36 | 1.27,66.36 1.27,77.47 | 1.27,77.47 1.27,88.58 | B49.B 1.28,21.92 1.27,21.91 | B43.B 1.29,33 1.27,33.02 | N37.B 1.32,44.09 1.27,44.13 | B31.B 1.35,55.17 1.27,55.25 | B25.B 1.38,66.25 1.27,66.36 | B19.B 1.4,77.34 1.27,77.47 | B13.B 3.02,88.42 2.86,88.58 1.27,88.58
  Route2 0.356: v29.84,119.38 24.77,119.38 24.13,118.75 21.59,118.75 20.96,119.38 8.57,119.38 5.08,115.76 v5.08,112.65
  Route15 0.356: v5.08,112.65 3.43,112.65 2.54,111.76 2.54,102.24 1.27,100.97 v1.27,99.7
  Bottom 0.356: $$PCB100.69 30.82,120.36 v29.84,119.38
COL_1  (via drill 0.5)
  Top 0.356: v21.21,115.63 21.21,112.84 19.05,110.81 16.39,110.81 B2.B 14.07,110.59 v13.34,109.86 | v13.34,8.89 14.61,8.89 15.88,10.16 15.88,10.54 B56.B | v13.34,20.32 15.56,20.32 16.19,20.96 16.19,21.9 B50.B | B44.B 16.17,31.73 v15.56,31.12 | B38.B 16.17,42.84 v15.24,41.91 | B32.B 16.17,54.27 v15.24,53.34 | B26.B 16.17,65.06 v15.24,64.14 | B20.B 16.17,76.49 v15.24,75.56 | B14.B 16.17,86.97 v15.56,86.36 | B8.B 16.17,98.08 v15.56,97.47
  Bottom 0.305: 29.84,117.48 28.58,116.21 24.77,116.21 23.5,117.48 22.54,117.48
  Bottom 0.356: 22.54,117.48 21.84,117.48 21.21,116.84 v21.21,115.63 | v13.34,109.86 13.34,97.47 | 13.34,97.47 13.34,86.36 | 13.34,86.36 13.34,75.56 | 13.34,75.56 13.34,64.14 | 13.34,64.14 13.34,53.34 | 13.34,53.34 10.8,50.8 10.8,45.72 13.34,43.18 13.34,41.91 | 13.34,41.91 13.34,31.12 | 13.34,31.12 13.34,27.94 12.07,26.67 12.07,21.59 v13.34,20.32 v13.34,8.89 | v15.56,31.12 13.34,31.12 | v15.24,41.91 13.34,41.91 | v15.24,53.34 13.34,53.34 | v15.24,64.14 13.34,64.14 | v15.24,75.56 13.34,75.56 | v15.56,86.36 13.34,86.36 | v15.56,97.47 13.34,97.47 | $$PCB100.71 31.42,119.05 29.84,117.48
COL_2  (via drill 0.5)
  Top 0.356: B3.B 27.4,110.59 25.4,108.59 v22.23,108.59 | v22.23,8.89 26.56,8.89 B57.B | B51.B 28.51,21.2 27.3,20 v22.23,20 | B45.B 28.51,32.32 27.3,31.12 v22.23,31.12 | B39.B 28.51,42.79 27.94,42.23 v22.23,42.23 | B33.B 28.51,53.91 27.94,53.34 v22.23,53.34 | B27.B 28.51,65.34 27.62,64.45 v22.23,64.45 | B21.B 28.51,75.81 27.94,75.25 v22.23,75.25 | B15.B 28.51,86.93 27.94,86.36 v22.23,86.36 | B9.B 28.51,98.36 27.94,97.79 v22.23,97.79
  Route15 0.356: v22.23,8.89 v22.23,20 v22.23,31.12 v22.23,42.23 v22.23,53.34 v22.23,64.45 v22.23,75.25 v22.23,86.36 v22.23,97.79 v22.23,108.59 29.84,108.59 32.39,111.12 v32.39,118.11
  Bottom 0.356: $$PCB100.75 32.62,118.34 v32.39,118.11
COL_3  (via drill 0.5)
  Top 0.356: v38.73,108.59 40.01,108.59 40.64,109.22 40.64,110.38 B4.B | B10.B 40.84,98.63 39.69,97.47 v38.73,97.47 | B16.B 44.3,88.42 v44.45,88.65 | B22.B 44.32,77.34 v44.45,77.47 | B28.B 44.24,66.25 v44.45,66.42 | B34.B 44.37,55.17 v44.45,55.37 | B40.B 44.4,44.09 v44.58,44.39 | B46.B 44.43,33 v44.45,33.34 | B52.B 44.44,21.92 v44.45,22.16 | B58.B 44.41,10.84 v44.45,11.05
  Route2 0.356: v44.45,88.65 44.45,89.54 38.73,95.25 v38.73,97.47
  Route15 0.356: v34.29,118.75 36.83,118.75 38.1,117.48 38.1,109.22 v38.73,108.59 v38.73,97.47 | v44.45,88.65 v44.45,77.47 v44.45,66.42 v44.45,55.37 v44.58,44.39 v44.45,33.34 v44.45,22.16 v44.45,11.05
  Bottom 0.356: $$PCB100.77 33.22,119.81 v34.29,118.75
COL_4  (via drill 0.5)
  Top 0.305: 53.66,77.47 56.2,77.47 v56.52,77.79
  Top 0.356: v41.15,117.09 41.66,117.09 41.91,116.84 53.98,116.84 56.52,114.3 v56.52,110.81 56.42,110.59 B5.B | v56.52,11.05 56.13,11.05 55.88,10.8 53.22,10.8 B59.B | B53.B 56.5,21.92 v56.52,22.16 | B47.B 56.5,33 v56.52,33.27 | B41.B 56.47,44.09 v56.52,44.26 | B35.B 56.44,55.17 v56.52,55.44 | B29.B 56.09,66.25 v56.52,66.42 | B23.B 53.66,77.47 | 56.47,77.74 v56.52,77.79 | B11.B 56.39,99.5 v56.52,99.76
  Route15 0.356: v56.52,110.81 v56.52,99.76 56.52,97.79 58.42,95.89 58.42,93.34 56.52,91.44 v56.52,77.79 v56.52,66.42 v56.52,55.44 v56.52,44.26 v56.52,33.27 v56.52,22.16 v56.52,11.05
  Bottom 0.356: $$PCB100.87 36.22,119.36 38.48,117.09 v41.15,117.09
COL_5  (via drill 0.5)
  Top 0.356: v68.9,11.05 65.56,10.8 B60.B | B54.B 68.89,21.92 v68.9,22.16 | B48.B 68.88,33 v68.9,33.27 | B42.B 68.85,44.09 v68.9,44.26 | B36.B 68.82,55.17 v68.9,55.37 | B30.B 68.79,66.25 v68.9,66.48 | B24.B 68.76,77.34 v68.9,77.47 | B18.B 68.74,88.42 v68.9,88.65 | B12.B 68.71,99.5 v68.9,99.7 | B6.B 68.8,110.59 v68.9,110.87 68.9,112.4 67.63,113.67 58.42,113.67 54.61,117.48 42.55,117.48 v41.27,118.75
  Route15 0.356: v68.9,110.87 v68.9,99.7 v68.9,88.65 v68.9,77.47 v68.9,66.48 v68.9,55.37 v68.9,44.26 v68.9,33.27 v68.9,22.16 v68.9,11.05
  Bottom 0.356: $$PCB100.89 36.82,120.03 38.1,118.75 v41.27,118.75
COMMON  (via drill 0.5)
  Top 0.356: B17.4 53.31,89.5 v53.34,88.9
  Route2 0.356: v53.34,88.9 53.34,92.08 50.8,94.62 v50.8,108.59
  Bottom 0.356: $$PCB100.134 50.32,109.06 v50.8,108.59
D  (via drill 0.5)
  Top 0.356: v49.53,86.04 50.76,86.04 B17.5
  Route2 0.356: v48.9,90.17 48.9,86.68 v49.53,86.04
  Bottom 0.356: $$PCB100.78 33.52,97.93 38.1,93.34 38.1,91.44 39.37,90.17 v48.9,90.17
DAC_2V5  (via drill 0.5)
  Route15 0.813: v27.43,164.97 27.43,164.08 28.32,163.19 37.59,163.19 38.1,163.7 42.55,163.7 42.67,163.83 59.05,163.83 60.33,162.56 60.33,160.02 58.42,158.12 58.42,150.5 57.15,149.23 52.07,149.23 50.93,148.08 50.93,142.34 v50.81,142.23
  Bottom 0.61: U3.5 v50.81,142.23 51.44,141.61 C11.1
  Bottom 0.813: J8.2 31.75,163.83 31.12,163.19 28.32,163.19 27.43,164.08 v27.43,164.97
DCIN
  Top 0.813: JP1.1 47.09,176 47.88,176.78 54.86,176.78 55.25,176.4 55.25,174.26 F1.P$1
GND  (via drill 0.5)
  Top 0.61: v39.75,126.37 39.75,132.97 38.1,134.62 38.1,138.68 37.08,139.7 37.08,141.99 v36.45,142.62 | v53.21,135.38 53.21,126.97 v53.54,126.65
  Top 0.813: LED1.C 62.42,173.8 v63.37,172.97
  Route2 0.305: v24,155.57 29.84,155.57 32.07,153.35 v34.29,153.35 | v22.67,160.53 22.67,158.88 22.54,158.75 22.54,153.99 22.86,153.67 23.18,153.67 23.56,153.29 23.56,150.05 24.77,149.23 38.1,149.23 | 38.1,149.23 38.73,149.23 41.15,151 41.15,153.8 v40.64,154.31 | 38.1,149.23 38.1,146.69 v36.51,145.1
  Route2 0.813: JP1.2 44.45,175.36 44.45,173.99 43.81,173.36 39.37,173.36 | 39.37,173.36 24.13,173.36 22.86,171.83 22.99,160.59 v22.67,160.53 | v41.27,165.1 40.01,165.1 39.37,165.74 39.37,173.36
  Bottom 0.305: U2.9 39.73,128.94 U2.13 39.29,128.49 U2.3 | v24,155.57 23.65,155.73 TFT1.43 23.66,155.73 23.5,155.89 23.5,157.48 24.25,158.23 TFT1.48 TFT1.49 TFT1.50 23.97,159.23 v22.67,160.53 | UTSC.10 34.25,153.4 v34.29,153.35 | v40.64,154.31 38.76,154.31 U4.1 | TFT1.6 29.92,137.23 31.12,138.43 31.12,139.06 31.75,139.7 32.77,139.7 R3.1
  Bottom 0.406: C21.2 62.04,151.9 61.59,151.45 61.59,149.54 61.28,149.23 59.82,149.23 C23.2
  Bottom 0.61: R3.1 36.08,140.08 C22.2 | C22.2 36.21,139.95 37.47,139.95 37.97,139.45 37.97,138.43 38.31,138.09 U1.2 43.23,138.09 43.43,138.3 43.43,139.57 43.69,139.83 C24.2 C4.2 49.65,139.83 49.78,139.7 49.78,137.29 50.04,137.03 C11.2 53.47,137.03 53.98,137.54 C12.2 | U3.2 37,143.18 36.83,143 | C22.2 36.2,140.03 36.2,142.37 v36.45,142.62 36.83,143 | Q1.2 35.91,145.7 v36.51,145.1 36.83,144.78 36.83,143 | C12.2 63.12,138.3 65.28,140.46 65.28,142.85 C16.2 | 39.73,128.94 39.73,126.25 v39.75,126.37 | C12.2 53.98,136.27 v53.21,135.38 | v53.54,126.65 54.6,126.65 54.61,126.63 | R9.2 38.73,154.28 U4.1 | R1.1 41.91,155.7 41.4,155.19 41.02,155.19 40.64,154.81 v40.64,154.31
  Bottom 0.813: C2.2 54.61,126.63 v53.54,126.65 J3.1 J4.1 | R4.1 C17.2 R2.1 41.78,165.61 v41.27,165.1 | v63.37,172.97 65.79,172.97 67.31,171.45 67.31,164.13 J12.4
  Bottom 1.016: J12.4 67.11,159.78 C9.2 R5.1 C8.2 | C8.2 C20.2 C10.2 C19.2 | C19.2 C18.2 C13.2 C14.2 C15.2 | C19.2 C3.2 65.23,142.9 C16.2 | C8.2 63.37,153.04 C21.2
  pour Bottom: 0,177.8 76.2,177.8 76.2,0 0,0
GPIO0-27_VREF  (via drill 0.5)
  Top 0.356: v19.69,117.73 23.5,117.48 26.67,114.3 38.73,114.3 40.01,115.57 40.01,119.38 40.64,120.02 57.15,120.02 59.05,121.92 66.04,121.92 66.67,122.56 66.67,147.64 v65.41,148.91
  Top 0.813: v36.96,170.56 v42.93,170.56
  Route2 0.813: v65.41,148.91 65.15,149.16 65.15,153.92 64.14,154.94 62.23,154.94 60.33,156.84 60.33,170.18 59.05,171.45 43.81,171.45 v42.93,170.56
  Bottom 0.356: $$PCB100.40 18.52,116.31 v19.69,117.73 | 63.69,148.91 C21.1
  Bottom 0.813: J10.1 36.94,168.51 36.94,170.54 v36.96,170.56 JP2.6 | 63.69,148.91 v65.41,148.91
GPIO28-45_VREF  (via drill 0.5)
  Top 0.61: v36.2,135.25 36.2,140.21 35.43,140.97 35.43,151 40.01,155.83 40.01,157.61 43.43,161.04 43.43,166.5 v41.53,168.4
  Route15 0.356: v22.1,112.27 22.1,115.44 22.86,116.21 28.58,116.21 36.2,123.83 v36.2,135.25
  Bottom 0.356: v36.2,135.25 36.2,137.17 C22.1 | $$PCB100.42 22.72,112.89 v22.1,112.27
  Bottom 0.61: C22.1 36.16,135.29 v36.2,135.25 | v41.53,168.4 J11.2
  Bottom 0.813: 39.48,168.51 J11.2 39.37,175.51 JP2.7
MISO  (via drill 0.5)
  Top 0.305: v33.02,161.29 30.48,161.29 29.84,160.66 29.84,151.77 v30.48,151.13
  Route15 0.305: v24.45,127.32 24.45,133.8 25.65,135 25.65,148.21 25.27,148.59 v24.13,148.59
  Bottom 0.305: $$PCB100.29 15.22,123.81 17.15,125.73 22.86,125.73 v24.45,127.32 | v24.13,148.59 26.67,148.59 27.3,149.23 27.3,150.5 27.54,150.73 TFT1.33 30.08,150.73 v30.48,151.13 | UTSC.3 34.25,160.06 v33.02,161.29
MOSI  (via drill 0.5)
  Route2 0.305: v25.27,151.26 25.78,151.26 26.92,152.4 31.75,152.4 33.34,150.81 36.51,150.81 37.47,151.77 37.47,154.62 36.32,155.76 v36.58,155.7
  Route15 0.305: v26.35,127 26.35,133.92 27.05,134.62 27.05,149.48 v25.27,151.26 | v57.78,161.29 57.78,159.38 57.15,158.75 57.15,155.57 56.77,155.19 37.08,155.19 v36.58,155.7
  Bottom 0.305: $$PCB100.33 16.42,124.05 17.46,125.09 24.45,125.09 v26.35,127 | TFT1.34 26.77,151.23 v25.27,151.26 | UTSC.7 36.38,156.67 36.51,156.53 36.51,156.27 v36.58,155.7 | R18.2 v57.78,161.29
N$1  (via drill 0.5)
  Route15 0.305: v38.99,124.59 56.01,124.59 57.15,125.73 v57.15,131.89
  Bottom 0.305: U2.2 37.1,128.03 36.83,127.76 36.83,124.84 37.21,124.46 38.86,124.46 v38.99,124.59 | v57.15,131.89 55.08,131.89 J4.2
  Bottom 0.813: J4.2 56.99,131.89 v57.15,131.89 J1.1 59.31,131.99 59.31,133.22 60.39,134.3 C6.2
N$2  (via drill 0.5)
  Top 0.813: v60.96,129.16 60.96,136.78 65.41,141.22 65.41,146.05 63.5,147.96 63.5,150.5 66.04,153.04 66.04,157.48 66.67,158.12 66.67,173.99 66.04,174.62 64.72,174.62 LED1.A
  Bottom 0.813: R6.1 61.91,129.1 v60.96,129.16
N$3
  Bottom 0.305: C2.1 58.17,126.54 58.17,124.97 57.78,124.59 42.42,124.59 41.21,125.8 U2.12
  Bottom 0.813: R7.1 60.4,126.04 59.82,126.62 C2.1
N$5  (via drill 0.5)
  Top 0.813: v58.67,134.24 v58.67,129.29 58.67,125.98 57.78,125.09 51.18,125.09 50.8,125.48 50.8,126.49 v50.93,126.62
  Bottom 0.305: U2.10 42.33,128.49 42.55,128.27 42.55,126.37 43.43,125.48 50.55,125.48 50.8,125.73 50.8,126.49 v50.93,126.62
  Bottom 0.61: C7.2 50.94,129.4 v50.93,126.62
  Bottom 0.813: v58.67,129.29 57.15,129.29 J3.2 | J2.1 58.65,134.21 v58.67,134.24
N$6
  Bottom 0.305: U2.8 42.7,129.38 44.45,127.64 46.72,127.64 L1.1
N$7
  Bottom 0.305: L2.1 34.93,130.26 34.93,128.91 34.95,128.94 U2.4
N$8  (via drill 0.5)
  Top 0.305: v28.19,125.98 28.19,143.13 29.84,144.78 31.24,144.78 v31.37,144.91
  Bottom 0.305: TFT1.1 28.45,134.37 28.19,134.11 28.19,126.11 v28.19,125.98 | v31.37,144.91 31.37,146 Q1.3
N$9
  Bottom 0.61: U3.4 52.73,144.12 53.98,142.88 C12.1
N$11  (via drill 0.5)
  Route15 0.305: v30.73,153.29 30.73,152.65 31.62,151.77 31.62,149.35 31.75,149.23 37.59,149.23 38.86,147.96 48.9,147.96 51.44,150.5 55.37,150.5 57.53,152.65 57.53,154.31 57.15,154.69 50.55,154.69 v49.53,153.67
  Bottom 0.305: UTSC.11 33.75,154.4 33.02,153.67 31.12,153.67 v30.73,153.29
  Bottom 0.813: R11.2 R12.1 v49.53,153.67
N$12  (via drill 0.5)
  Route15 0.61: v49.53,147.32 v36.83,147.32
  Bottom 0.61: R12.2 v49.53,147.32 | Q1.1 36.42,147.6 v36.83,147.32
N$19  (via drill 0.5)
  Top 0.356: v14.61,112.08 7.3,112.08 6.35,113.03 6.35,168.91 8.89,171.45 21.59,171.45 22.86,170.18 22.86,164.47 23.5,163.83 40.64,163.83 v41.91,162.56
  Bottom 0.356: $$PCB100.28 14.92,112.39 v14.61,112.08 | v41.91,162.56 R1.2
N$23
  Top 0.356: B6.A 68.04,106.59 69.22,105.41 70.8,105.41 71.12,105.09 71.12,103.32 D6.A
N$24  (via drill 0.5)
  Route2 0.356: v35.56,117.54 35.56,133.35 33.66,135.25 v33.02,135.25
  Bottom 0.356: $$PCB100.82 34.72,116.7 v35.56,117.54 | v33.02,135.25 33.02,137.15 R3.2
N$25  (via drill 0.5)
  Route15 0.356: v44.45,112.33 73.98,112.33 74.93,113.28 74.93,153.04 75.56,153.67 75.56,168.28 73.66,170.18 v53.98,170.18
  Bottom 0.356: $$PCB100.84 35.32,112.89 35.88,112.33 v44.45,112.33 | v53.98,170.18 52.07,170.18 51.44,169.55 R4.2
N$26  (via drill 0.5)
  Top 0.305: v42.29,153.67 42.16,153.54 42.16,134.24 40.64,132.72 40.64,125.86 40.26,125.48 35.18,125.48 34.8,125.09 31.5,125.09 30.99,124.59 v29.84,124.59
  Bottom 0.305: TFT1.2 29.36,135.23 29.46,135.13 29.46,134.24 28.96,133.73 28.96,127.13 29.84,126.24 v29.84,124.59 | v42.29,153.67 42.29,151.99 R13.1
N$27  (via drill 0.5)
  Top 0.305: v28.07,124.59 28.07,123.06 28.58,122.56 44.32,122.56 45.85,124.08 v45.85,153.67
  Bottom 0.305: TFT1.3 24.23,135.73 23.75,135.25 23.75,131.32 24.89,130.18 26.92,130.18 27.56,129.54 27.56,126.62 26.67,125.73 26.67,124.84 27.05,124.46 27.94,124.46 v28.07,124.59 | v45.85,153.67 45.85,151.95 R14.1
N$28  (via drill 0.5)
  Route2 0.305: v24.13,136.53 24.51,136.14 44.07,136.14 44.45,136.53 44.45,161.93 v45.09,162.56
  Bottom 0.305: TFT1.4 24.42,136.23 v24.13,136.53 | v45.09,162.56 R15.1
N$30  (via drill 0.5)
  Top 0.356: v64.14,120.02 72.39,120.02 73.66,121.28 v73.66,154.94
  Bottom 0.356: v73.66,154.94 72.71,155.89 R5.2 | $$PCB100.168 60.52,115.77 60.96,116.21 63.5,116.21 64.14,116.84 v64.14,120.02
N$31  (via drill 0.5)
  Top 0.356: v11.49,120.4 8.64,120.4 7.62,121.28 7.62,168.28 v9.53,170.18
  Route15 0.356: v9.53,170.18 9.84,170.18 9.65,170.37 22.03,170.37 22.86,169.55 43.18,169.55 43.75,170.12 v45.09,170.12
  Bottom 0.356: $$PCB100.30 15.52,115.53 14.61,116.84 12.7,116.84 11.49,118.05 v11.49,120.4 | v45.09,170.12 R2.2
N$32
  Bottom 0.305: TFT1.32 TFT1.31 TFT1.30 TFT1.29 TFT1.28 TFT1.27 TFT1.26 TFT1.25 TFT1.24 TFT1.23 TFT1.22 TFT1.21 TFT1.20 TFT1.19 TFT1.18 TFT1.17 TFT1.16 TFT1.15
N$40
  Top 0.356: B2.A 18.83,106.59 20,105.41 21.27,105.41 21.59,105.09 21.59,103.5 D2.A
N$41
  Top 0.356: B3.A 30.89,106.59 32.07,105.41 33.66,105.41 33.97,105.09 33.97,103.46 D3.A
N$42
  Top 0.356: B1.A 6.12,106.59 7.3,105.41 9.21,105.41 9.53,105.09 9.53,103.23 D1.A
N$44
  Top 0.356: B4.A 43.27,106.59 44.77,105.09 46.36,105.09 46.67,104.78 46.67,103.26 D4.A
N$45
  Top 0.356: B5.A 55.97,106.59 57.15,105.41 58.42,105.41 58.74,105.09 58.74,103.37 D5.A
N$52
  Top 0.356: B13.A 6.39,84.42 7.62,83.19 9.21,83.19 9.53,82.87 9.53,81.07 D13.A
N$53
  Top 0.356: B18.A 67.98,84.42 69.22,83.19 70.8,83.19 71.12,82.87 71.12,81.16 D18.A
N$54
  Top 0.356: B14.A 18.77,84.42 20,83.19 21.59,83.19 21.91,82.87 21.91,81.02 D14.A
N$55
  Top 0.356: B15.A 30.83,84.42 32.07,83.19 33.66,83.19 33.97,82.87 33.97,81.29 D15.A
N$56
  Top 0.356: B16.A 43.22,84.42 44.77,82.87 46.36,82.87 46.67,82.55 46.67,81.09 D16.A
N$57
  Top 0.356: D23.A 58.93,71.88 58.74,72.07 57.15,72.07 55.88,73.34 53.26,73.34 B23.A
N$64
  Top 0.356: B7.A 6.41,95.5 7.62,94.3 9.21,94.3 9.53,93.98 9.53,92.15 D7.A
N$65
  Top 0.356: B12.A 68.33,95.5 69.53,94.3 70.8,94.3 71.12,93.98 71.12,92.24 D12.A
N$66
  Top 0.356: B8.A 19.11,95.5 20.32,94.3 21.59,94.3 21.91,93.98 21.91,92.1 D8.A
N$67
  Top 0.356: B9.A 31.5,95.5 32.7,94.3 37.15,94.3 37.47,93.98 37.47,92.13 D9.A
N$68
  Top 0.356: B10.A 43.24,95.5 44.45,94.3 46.36,94.3 46.67,93.98 46.67,92.17 D10.A
N$69  (via drill 0.5)
  Top 0.356: B11.A 55.94,95.5 56.2,95.25 v57.15,95.25
  Bottom 0.356: v57.15,95.25 57.15,94.62 57.47,94.3 58.42,94.3 59.05,93.66 59.05,92.17 D11.A
N$76
  Top 0.356: B19.A 6.36,73.34 7.62,72.07 9.21,72.07 9.53,71.76 9.53,69.98 D19.A
N$77
  Top 0.356: D24.A 71.27,71.93 71.12,72.07 69.22,72.07 67.94,73.34 B24.A
N$78
  Top 0.356: D20.A 21.92,71.43 21.59,71.76 20.32,71.76 18.73,73.34 B20.A
N$79
  Top 0.356: D21.A 34.26,71.79 33.97,72.07 32.39,72.07 31.12,73.34 B21.A
N$80
  Top 0.356: D22.A 45.72,70.8 46.04,70.8 46.36,71.12 46.36,71.76 46.04,72.07 45.09,72.07 43.81,73.34 B22.A
N$88
  Top 0.356: D25.A 9.58,60.59 9.21,60.96 7.94,60.96 6.67,62.23 3.86,62.23 B25.A
N$89
  Top 0.356: D30.A 71.27,60.18 70.8,60.64 69.85,60.64 68.26,62.23 65.54,62.23 B30.A
N$90
  Top 0.356: D26.A 21.92,60.63 21.59,60.96 20,60.96 18.73,62.23 16.19,62.23 B26.A
N$91
  Top 0.356: D27.A 34.26,60.36 33.66,60.96 32.39,60.96 31.12,62.23 28.53,62.23 B27.A
N$92
  Top 0.356: D28.A 46.59,60.72 46.36,60.96 45.09,60.96 43.81,62.23 40.87,62.23 B28.A
N$93
  Top 0.356: D29.A 58.93,60.77 58.74,60.96 57.15,60.96 55.88,62.23 53.2,62.23 B29.A
N$100
  Top 0.356: D31.A 9.58,49.47 9.21,49.85 7.62,49.85 6.35,51.12 3.88,51.12 B31.A
N$101
  Top 0.356: D36.A 71.27,49.38 70.8,49.85 69.53,49.85 68.26,51.12 65.57,51.12 B36.A
N$102
  Top 0.356: D32.A 21.92,49.52 21.59,49.85 19.69,49.85 18.42,51.12 16.22,51.12 B32.A
N$103
  Top 0.356: D33.A 34.26,49.56 33.97,49.85 32.7,49.85 31.43,51.12 28.56,51.12 B33.A
N$104
  Top 0.356: D34.A 46.59,49.61 46.36,49.85 44.77,49.85 43.5,51.12 40.9,51.12 B34.A
N$105
  Top 0.356: D35.A 58.93,49.66 58.74,49.85 57.15,49.85 55.88,51.12 53.23,51.12 B35.A
N$112
  Top 0.356: D37.A 9.58,38.36 9.21,38.74 7.62,38.74 6.35,40.01 3.91,40.01 N37.A
N$113
  Top 0.356: D42.A 71.27,38.27 70.8,38.74 69.22,38.74 67.94,40.01 65.6,40.01 B42.A
N$114
  Top 0.356: D38.A 21.92,38.41 21.59,38.74 19.69,38.74 18.42,40.01 16.25,40.01 B38.A
N$115
  Top 0.356: D39.A 34.26,38.45 33.97,38.74 32.39,38.74 31.12,40.01 28.59,40.01 B39.A
N$116
  Top 0.356: D40.A 46.59,38.5 46.36,38.74 44.45,38.74 43.18,40.01 40.92,40.01 B40.A
N$117
  Top 0.356: D41.A 58.93,38.54 58.74,38.74 57.15,38.74 55.88,40.01 53.26,40.01 B41.A
N$124
  Top 0.356: D43.A 9.58,27.25 9.21,27.62 7.62,27.62 6.35,28.89 3.94,28.89 B43.A
N$125
  Top 0.356: D48.A 71.27,27.16 70.8,27.62 69.22,27.62 67.94,28.89 65.63,28.89 B48.A
N$126
  Top 0.356: D44.A 21.92,27.29 21.59,27.62 20,27.62 18.73,28.89 16.28,28.89 B44.A
N$127
  Top 0.356: D45.A 34.26,27.34 33.97,27.62 32.7,27.62 31.43,28.89 28.62,28.89 B45.A
N$128
  Top 0.356: D46.A 46.59,27.38 46.36,27.62 44.77,27.62 43.5,28.89 40.95,28.89 B46.A
N$129
  Top 0.356: D47.A 58.93,27.43 58.74,27.62 56.83,27.62 55.56,28.89 53.29,28.89 B47.A
N$136
  Top 0.356: B49.A 4.94,17.92 6.35,16.51 8.89,16.51 9.53,15.88 9.53,14.56 D49.A
N$137
  Top 0.356: B54.A 67.81,17.92 69.22,16.51 70.8,16.51 71.12,16.19 71.12,14.65 D54.A
N$138
  Top 0.356: B50.A 18.28,17.92 19.69,16.51 21.59,16.51 21.91,16.19 21.91,14.52 D50.A
N$139
  Top 0.356: B51.A 30.34,17.92 31.75,16.51 33.97,16.51 34.29,16.19 34.29,14.54 D51.A
N$140
  Top 0.356: B52.A 43.04,17.92 44.45,16.51 46.36,16.51 46.67,16.19 46.67,15.56 46.99,15.24 46.99,14.9 D52.A
N$141
  Top 0.356: B53.A 55.11,17.92 56.52,16.51 58.74,16.51 59.05,16.19 59.05,14.63 D53.A
N$148
  Top 0.356: D55.A 11.66,4.85 11.11,5.4 7.62,5.4 6.35,6.67 4,6.67 B55.A
N$149
  Top 0.356: D60.A 67.8,6.5 67.31,6.98 65.67,6.98 B60.A
N$150
  Top 0.356: D56.A 21.34,3.42 20.32,4.45 20.32,5.72 19.05,6.98 16.32,6.98 B56.A
N$151
  Top 0.356: D57.A 33.41,3.42 33.02,3.81 33.02,5.72 31.75,6.98 28.66,6.98 B57.A
N$152
  Top 0.356: D58.A 45.47,3.42 45.09,3.81 45.09,5.72 43.81,6.98 40.99,6.98 B58.A
N$153
  Top 0.356: D59.A 57.2,5.67 55.88,6.98 53.33,6.98 B59.A
R16  (via drill 0.5)
  Route2 0.305: v24.13,137.8 25.15,136.78 42.8,136.78 43.69,137.67 | 43.69,162.94 44.45,163.7 47.37,163.7 48.26,162.81 v48.26,162.56
  Route2 0.356: 43.69,137.67 43.69,144.78 43.94,145.03 43.94,146.18 43.69,146.43 43.69,162.94
  Bottom 0.305: TFT1.5 25.19,136.73 v24.13,137.8 | R16.1 48.39,159.64 48.39,162.43 v48.26,162.56
ROW_0  (via drill 0.5)
  Top 0.356: D1.C 4.58,102.87 v1.27,102.87 1.27,101.6 1.91,100.97 17.15,100.97 | D6.C 66.57,101.18 66.36,100.97 54.29,100.97 | 54.29,100.97 41.91,100.97 | 41.91,100.97 29.84,100.97 | 29.84,100.97 17.15,100.97 | D2.C 17.22,101.04 17.15,100.97 | D3.C 29.56,101.25 29.84,100.97 | D4.C 41.89,100.98 41.91,100.97 | D5.C 54.23,101.03 54.29,100.97
  Bottom 0.356: $$PCB100.3 7.42,121.09 6.35,120.02 2.54,120.02 1.27,118.75 v1.27,102.87
ROW_1  (via drill 0.5)
  Top 0.356: v29.21,92.08 32.72,92.08 D9.C | D12.C 50.18,92.09 v50.16,92.08 | D10.C 39.7,92.09 v39.69,92.08 | D8.C 14.62,92.09 v14.61,92.08 14.61,91.12 13.34,89.85 5.4,89.85 5.08,90.17 5.08,91.89 D7.C
  Route2 0.305: v29.21,92.08 v14.61,92.08
  Route15 0.356: v50.16,92.08 v39.69,92.08 v29.21,92.08
  Bottom 0.356: $$PCB100.60 28.12,93.17 v29.21,92.08 | v50.16,92.08 54.27,92.08 D11.C
ROW_2  (via drill 0.5)
  Top 0.356: D15.C 29.29,81.28 v27.3,81.28 27.3,79.06 | D18.C 65.77,81.01 63.82,79.06 41.91,79.06 | 41.91,79.06 40.32,79.06 39.69,78.42 36.51,78.42 35.88,79.06 27.3,79.06 | 27.3,79.06 13.97,79.06 | 13.97,79.06 5.08,79.06 4.76,79.38 4.76,80.89 D13.C | D14.C 14.97,81.01 13.97,80.01 13.97,79.06 | D16.C 41.89,79.07 41.91,79.06
  Bottom 0.356: $$PCB100.58 27.52,81.5 v27.3,81.28
ROW_3  (via drill 0.5)
  Top 0.356: D21.C 29.48,69.85 v27.3,69.85 27.3,67.63 | D24.C 66.57,68.16 66.04,67.63 54.29,67.63 | 54.29,67.63 41.91,67.63 | 41.91,67.63 27.3,67.63 | 27.3,67.63 17.15,67.63 | 17.15,67.63 5.4,67.63 5.08,67.95 5.08,69.73 D19.C | D20.C 17.22,67.7 17.15,67.63 | D22.C 41.89,67.64 41.91,67.63 | D23.C 54.23,67.69 54.29,67.63
  Bottom 0.356: $$PCB100.54 26.32,70.84 v27.3,69.85
ROW_4  (via drill 0.5)
  Top 0.356: D27.C 29.34,59.06 v26.67,59.06 26.67,56.83 | D30.C 66.57,57.04 66.36,56.83 54.29,56.83 | 54.29,56.83 41.91,56.83 | 41.91,56.83 26.67,56.83 | 26.67,56.83 17.15,56.83 | 17.15,56.83 5.4,56.83 5.08,57.15 5.08,58.64 D25.C | D26.C 17.22,56.91 17.15,56.83 | D28.C 41.89,56.85 41.91,56.83 | D29.C 54.23,56.89 54.29,56.83
  Bottom 0.356: $$PCB100.52 25.72,60.01 v26.67,59.06
ROW_5  (via drill 0.5)
  Top 0.356: D33.C 29.43,47.63 v26.04,47.63 26.04,45.4 | D36.C 66.57,45.93 66.04,45.4 54.29,45.4 | 54.29,45.4 41.91,45.4 | 41.91,45.4 26.04,45.4 | 26.04,45.4 17.15,45.4 | 17.15,45.4 5.08,45.4 4.76,45.72 4.76,47.64 D31.C | D35.C 54.23,45.46 54.29,45.4 | D34.C 41.89,45.42 41.91,45.4 | D32.C 17.22,45.48 17.15,45.4
  Bottom 0.356: $$PCB100.48 24.52,49.14 v26.04,47.63
ROW_6  (via drill 0.5)
  Top 0.356: D39.C 29.4,36.83 v25.4,36.83 25.4,34.61 | D42.C 66.57,35.14 66.04,34.61 53.98,34.61 | 53.98,34.61 41.91,34.61 | 41.91,34.61 25.4,34.61 | 25.4,34.61 17.15,34.61 | 17.15,34.61 5.4,34.61 5.08,34.93 5.08,36.48 D37.C | D38.C 17.22,34.68 17.15,34.61 | D41.C 54.23,34.86 53.98,34.61 | D40.C 41.89,34.62 41.91,34.61
  Bottom 0.356: $$PCB100.46 23.92,38.31 v25.4,36.83
ROW_7  (via drill 0.5)
  Top 0.356: D44.C 17.15,25.52 17.15,23.5 | D48.C 64.33,25.59 62.23,23.5 54.29,23.5 | 54.29,23.5 41.91,23.5 | 41.91,23.5 29.53,23.5 | 29.53,23.5 17.15,23.5 | 17.15,23.5 13.97,23.5 | 13.97,23.5 5.08,23.5 4.76,23.81 4.76,25.47 D43.C | D45.C 29.56,23.52 29.53,23.5 | D46.C 41.89,23.51 41.91,23.5 | D47.C 54.23,23.56 54.29,23.5 | v13.97,25.4 13.97,23.5
  Bottom 0.356: $$PCB100.36 17.32,28.75 v13.97,25.4
ROW_8  (via drill 0.5)
  Top 0.356: D54.C 63.08,14.51 60.96,12.38 54.29,12.38 | D53.C 54.29,14.45 54.29,12.38 | 29.53,14.48 D51.C 29.46,14.61 v26.04,14.61 26.04,12.38 | 54.29,12.38 41.91,12.38 | 41.91,12.38 26.04,12.38 | 26.04,12.38 17.15,12.38 | 17.15,12.38 5.4,12.38 5.08,12.7 5.08,14.31 D49.C | D50.C 17.22,12.46 17.15,12.38 | D52.C 41.89,12.4 41.91,12.38
  Bottom 0.356: $$PCB100.64 29.32,94.51 30.48,93.34 30.48,19.05 v26.04,14.61
ROW_9  (via drill 0.5)
  Top 0.356: D59.C 52.07,2.88 52.07,0.95 | 41.27,3.41 D58.C 41.26,0.97 41.27,0.95 | 29.21,3.08 D57.C 29.56,0.98 29.53,0.95 | D56.C 16.51,3.26 16.51,0.95 | v1.27,5.72 5.72,5.72 6.67,4.76 6.67,3.5 D55.C 6.99,3.19 6.99,1.27 7.3,0.95 16.51,0.95 | D60.C 63.1,1.19 62.87,0.95 52.07,0.95 | 52.07,0.95 41.27,0.95 | 41.27,0.95 29.53,0.95 | 29.53,0.95 16.51,0.95
  Bottom 0.356: $$PCB100.5 8.02,120.42 6.99,119.38 4.45,119.38 2.54,117.48 2.54,6.98 v1.27,5.72
RT_CS_3V  (via drill 0.5)
  Top 0.305: v26.67,118.11 26.67,125.73 27.56,126.62 27.56,161.54 28.89,162.88 35.88,162.88 36.51,162.24 36.51,160.97 v36.2,160.66
  Route15 0.305: v36.2,160.66 36.7,160.66 36.96,160.91 51.05,160.91 v51.44,161.29
  Bottom 0.305: $$PCB100.23 13.42,118.66 13.97,118.11 18.42,118.11 19.05,118.75 20.32,118.75 20.96,118.11 v26.67,118.11 | 35.75,157.67 UTSC.5 35.56,157.78 35.56,159.07 36.2,159.7 v36.2,160.66 | v51.44,161.29 R8.2
RT_INT  (via drill 0.5)
  Top 0.305: v38.73,162.56 38.73,160.02 38.42,159.83 33.66,159.83 33.34,160.02 v32.39,160.02 32.39,144.15 31.75,143.51 30.35,143.51 28.96,142.11 28.96,127.13 30.04,126.05 v32.39,126.05
  Bottom 0.305: $$PCB100.81 34.42,124.01 33.97,124.46 32.89,124.46 32.39,124.97 v32.39,126.05 | 32.48,159.93 v32.39,160.02 33.34,160.02 33.75,159.61 UTSC.2 | R9.1 v38.73,162.56
SCLK  (via drill 0.5)
  Route15 0.305: v25.4,124.52 25.4,133.86 26.29,134.75 26.29,149.23 25.65,149.86 24.77,149.86 24.13,150.5 24.13,152.4 24.38,152.65 25.4,152.65 v25.34,152.72 24.77,153.42 24.77,155.7 26.67,157.35 26.67,158.75 30.16,162.24 34.61,162.24 34.93,161.93 v34.93,161.29 35.56,161.93 37.85,161.93 38.1,161.67 50.67,161.67 51.05,162.18 51.82,162.18 52.2,161.67 54.1,161.67 v54.61,161.29
  Bottom 0.305: $$PCB100.35 17.02,123.7 17.84,124.52 v25.4,124.52 | TFT1.37 26.37,152.73 v25.34,152.72 | UTSC.4 34.75,161.11 v34.93,161.29 | v54.61,161.29 R17.2
TFT_3V3  (via drill 0.5)
  Top 0.305: v24.13,139.06 24.13,145.42 26.67,147.96 26.67,153.61 26.05,154.23 25.92,154.23 v25.53,154.62
  Top 0.356: v36.58,157.61 37.34,157.61 37.85,157.1 37.85,154.94 37.21,154.31 v35.24,154.31
  Top 0.813: v43.69,134.75 43.69,144.91 v43.18,145.42
  Route15 0.305: v35.24,154.31 31.43,154.31 30.8,154.94 v30.8,156.21 26.42,156.21 25.53,155.45 v25.53,154.62
  Route15 0.813: v39.88,148.84 39.88,149.99 39.37,150.5 37.47,150.5 36.2,151.77 36.2,152.78 35.31,153.67 35.31,154.24 v35.24,154.31
  Bottom 0.305: TFT1.9 TFT1.8 TFT1.7 25.46,137.73 v24.13,139.06 | UTSC.14 31.25,156.67 v30.8,156.21 | v25.53,154.62 26.05,154.23 TFT1.40 TFT1.41 TFT1.42 | UTSC.9 34.75,154.8 v35.24,154.31 | UTSC.6 36.2,157.17
  Bottom 0.356: UTSC.6 36.13,157.17 v36.58,157.61 | U4.3 35.56,153.16 35.31,153.42 35.31,154.24 v35.24,154.31
  Bottom 0.61: R13.2 R14.2 | R14.2 45.87,145.91 | 45.87,145.91 46.36,145.42 52.07,145.42 52.7,146.05 52.7,148.84 R11.1 R10.2 | U1.5 42.94,137.15 43.18,136.91 43.18,135.25 v43.69,134.75 | 45.87,145.91 45.38,145.42 v43.18,145.42 | R15.2 45.09,155.57 45.72,154.94 46.99,154.94 47.62,154.31 47.62,149.86 46.99,149.23 45.96,149.23 R14.2
  Bottom 0.813: R18.1 R17.1 R8.1 R16.2 R15.2 | R13.2 40.55,149.14 v39.88,148.84
TFT_CS_3V  (via drill 0.5)
  Route15 0.305: v23.24,130.18 23.24,128.52 22.61,127.89 v22.61,120.02
  Bottom 0.305: $$PCB100.27 14.62,120.64 15.24,120.02 v22.61,120.02 | TFT1.38 27.43,153.23 26.99,153.67 24.77,153.67 22.48,151.89 22.48,131.57 23.24,130.81 v23.24,130.18
TFT_DC_3V  (via drill 0.5)
  Top 0.305: v34.61,126.18 v34.61,152.08
  Bottom 0.305: $$PCB100.83 35.02,124.37 34.61,124.78 v34.61,126.18 | TFT1.36 34.46,152.23 v34.61,152.08
TFT_RESET  (via drill 0.5)
  Route15 0.813: v40.01,152.27 55.12,152.27 v56.52,153.67
  Bottom 0.305: TFT1.10 29.38,139.23 29.84,139.7 29.84,146.69 33.02,149.86 37.59,149.86 38.48,150.75 38.48,152.13 U4.2
  Bottom 0.813: U4.2 40.07,152.21 v40.01,152.27 | v56.52,153.67 R10.1
USB_DM  (via drill 0.5)
  Route2 0.356: v60.33,117.48 68.58,117.48 74.3,123.19 74.3,153.35 74.93,153.99 74.93,158.75 73.03,160.66 66.67,160.66 65.41,159.38 63.18,159.38 62.55,160.02 v62.55,160.66
  Bottom 0.356: $$PCB100.165 59.62,120.58 59.05,120.02 59.05,118.11 59.69,117.48 v60.33,117.48 | v62.55,160.66 62.55,163.87 J12.2
USB_DP  (via drill 0.5)
  Route15 0.356: v60.33,120.02 61.59,118.75 69.85,118.75 74.3,123.19 74.3,153.35 74.93,153.99 74.93,158.75 73.03,160.66 v64.77,160.66
  Bottom 0.356: $$PCB100.167 60.22,120.12 v60.33,120.02 | v64.77,160.66 64.77,163.76 J12.3
VBUSA  (via drill 0.5)
  Top 0.61: v46.61,137.03 46.61,141.86 46.99,142.24 48.68,142.24 v60.11,153.67
  Route2 0.813: v24.13,165.1 24.13,164.59 25.15,163.58 37.85,163.58 38.1,163.83 42.55,163.83 43.18,164.47 48.26,164.47 v50.16,162.56
  Bottom 0.61: C24.1 v46.61,137.03
  Bottom 0.813: J9.1 v24.13,165.1 | v50.16,162.56 60.11,162.56
  Bottom 1.016: J12.1 60.11,162.56 v60.11,153.67 60.11,152.31 C23.1
X+
  Bottom 0.305: TFT1.45 29.32,156.73 29.84,156.21 29.84,155.57 30.16,155.26 31.43,155.26 31.75,155.57 31.75,155.89 32.02,156.17 UTSC.13
X-  (via drill 0.5)
  Route2 0.305: v25.08,157.16 29.84,157.16 v31.12,158.43
  Bottom 0.305: UTSC.16 31.25,157.67 31.12,157.8 v31.12,158.43 | TFT1.44 25.38,156.23 25.08,156.53 v25.08,157.16
Y+
  Bottom 0.305: UTSC.15 31.12,157.17 31.12,157.16 31.05,157.23 TFT1.46
Y-
  Bottom 0.305: TFT1.47 29.46,157.73 30.16,158.43 30.16,159.07 30.48,159.38 31.43,159.38 31.75,159.07 33.02,159.07 33.25,158.84 UTSC.1